# EAGLE schematic Duckuino (EAGLE 8.0.0)
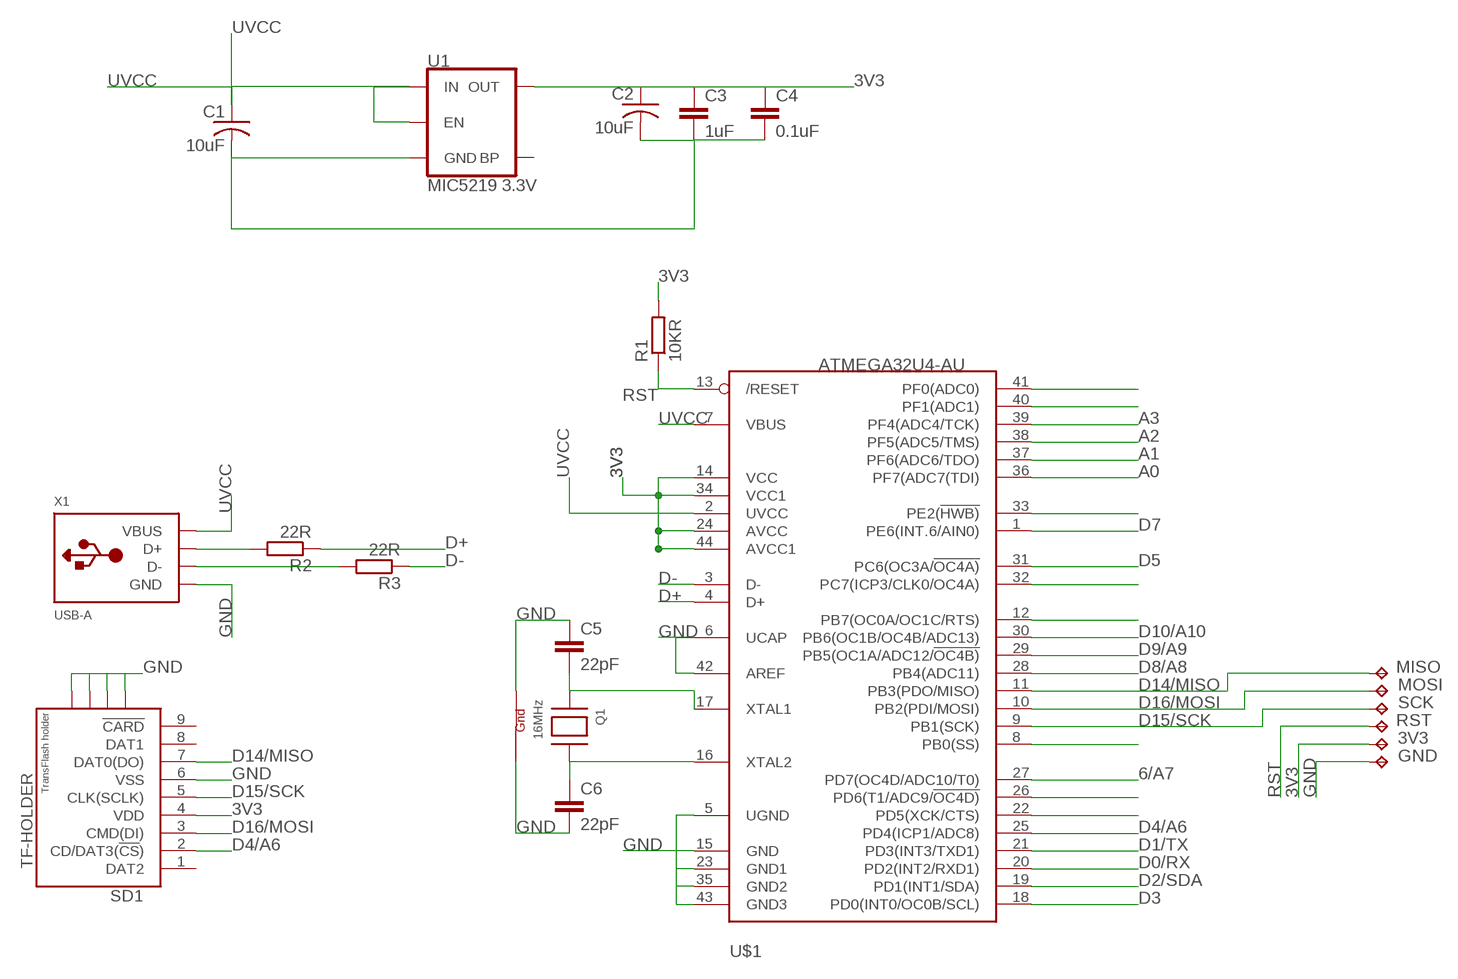
[diagram p0: schematic, sheet 1]

## Parts
3V3  TPTP11R  [TP11R]
C1  10uF  C-USC0603  [C0603]
C2  10uF  C-USC0603  [C0603]
C3  1uF  C-EUC0603  [C0603]
C4  0.1uF  C-EUC0603  [C0603]
C5  22pF  C-EUC0603  [C0603]
C6  22pF  C-EUC0603  [C0603]
GND  TPTP11R  [TP11R]
MISO  TPTP11R  [TP11R]
MOSI  TPTP11R  [TP11R]
Q1  16MHz  XTAL-4-3225  [NX3225]
R1  10KR  RR0603  [R0603]
R2  22R  RR0603  [R0603]
R3  22R  RR0603  [R0603]
RST  TPTP11R  [TP11R]
SCK  TPTP11R  [TP11R]
SD1  TF-HOLDER  [TF-PULL]
U1  MIC5219 3.3V  V_REG_MIC52193.3V  [SOT23-5]
U$1  ATMEGA32U4-AU  [TQFP44]
X1  USB-A  [MOLEX_480371000]

## Nets
3V3: 3V3.TP C2.1 C3.1 C4.1 R1.2 SD1.4(VDD) U1.5(OUT) U$1.14(VCC) U$1.24(AVCC) U$1.34(VCC1) U$1.44(AVCC1)
6/A7: U$1.27(PD7(OC4D/ADC10/T0))
A0: U$1.36(PF7(ADC7(TDI))
A1: U$1.37(PF6(ADC6/TDO))
A2: U$1.38(PF5(ADC5/TMS))
A3: U$1.39(PF4(ADC4/TCK))
D0/RX: U$1.20(PD2(INT2/RXD1))
D1/TX: U$1.21(PD3(INT3/TXD1))
D2/SDA: U$1.19(PD1(INT1/SDA))
D3: U$1.18(PD0(INT0/OC0B/SCL))
D4/A6: SD1.2(CD/DAT3(!CS!)) U$1.25(PD4(ICP1/ADC8))
D5: U$1.31(PC6(OC3A/!OC4A))
D7: U$1.1(PE6(INT.6/AIN0))
D8/A8: U$1.28(PB4(ADC11))
D9/A9: U$1.29(PB5(OC1A/ADC12/!OC4B))
D10/A10: U$1.30(PB6(OC1B/OC4B/ADC13))
D14/MISO: MISO.TP SD1.7(DAT0(DO)) U$1.11(PB3(PDO/MISO))
D15/SCK: SCK.TP SD1.5(CLK(SCLK)) U$1.9(PB1(SCK))
D16/MOSI: MOSI.TP SD1.3(CMD(DI)) U$1.10(PB2(PDI/MOSI))
D+: R2.1 U$1.4(D+)
D-: R3.1 U$1.3(D-)
GND: C1.2 C2.2 C3.2 C4.2 C5.1 C6.2 GND.TP Q1.2(G2) Q1.4(G1) SD1.6(VSS) SD1.S1 SD1.S2 SD1.S3 SD1.S4 U1.2(GND) U$1.5(UGND) U$1.6(UCAP) U$1.15(GND) U$1.23(GND1) U$1.35(GND2) U$1.42(AREF) U$1.43(GND3) X1.4(GND)
N$2: U$1.41(PF0(ADC0))
N$3: R2.2 X1.3(D+)
N$4: R3.2 X1.2(D-)
N$5: C6.1 Q1.3(X2) U$1.16(XTAL2)
N$6: U$1.40(PF1(ADC1))
N$7: C5.2 Q1.1(X1) U$1.17(XTAL1)
N$12: U$1.33(PE2(!HWB))
N$15: U$1.32(PC7(ICP3/CLK0/OC4A))
N$16: U$1.12(PB7(OC0A/OC1C/RTS))
N$23: U$1.8(PB0(SS))
N$25: U$1.26(PD6(T1/ADC9/!OC4D))
N$26: U$1.22(PD5(XCK/CTS))
RST: R1.1 RST.TP U$1.13(/RESET)
UVCC: C1.1 U1.1(IN) U1.3(EN) U$1.2(UVCC) U$1.7(VBUS) X1.1(VBUS)
Unconnected: SD1.1(DAT2) SD1.8(DAT1) SD1.9(!CARD) U1.4(BP)

## Library data of the parts
3V3 GND MISO MOSI RST SCK = testpad:TP: Test pad
C1 C2 = rcl:C-US: CAPACITOR, American symbol
C3-C6 = rcl:C-EU: CAPACITOR, European symbol
Q1 = adafruit:XTAL-4: Classic 4-pin 3.2 x 2.5mm crystal
R1-R3 = eagle-ltspice:R: RESISTOR, European symbol; SPICEMODEL: NONE; SPICEPREFIX: R
SD1 = sd:TF-HOLDER: TF / Micro SD socket is PUSH-PUSH type, the card can be pushed into and auto locked and pushed out by simply press the card. Surface Mounting type.
U1 = SparkFun-IC-Power:V_REG_MIC5219: V_REG MIC5219 Standard 3.3V and 5V 500mA LDO voltage regulator in SOT-23 layout. Micrel part MIC5219. BP (by-pass) pin is used to lower output noise with 470pF cap, may be left open.; PROD_ID: VREG-09872
U$1 = adafruit:ATMEGA32U4: http://www.ladyada.net/library/eagle
X1 = adafruit:USB-A: USB type A 'plug' Used for things that can directly connect to a USB port, say USB key

## Net classes
0 OSH: width 0.152 mm, drill 0.33 mm, clearance 0.152 mm